# EAGLE schematic DRV8871 (EAGLE 9.1.3)
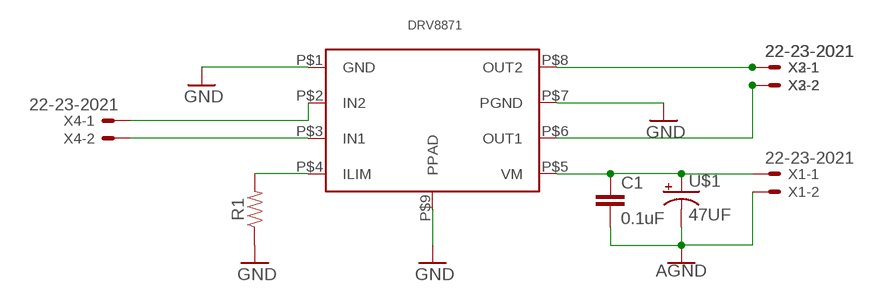
[diagram p0: schematic, sheet 1]

## Parts
C1  0.1uF  0.1UF-0402-16V-10%  [0402]
R1  RESISTOR0402  [0402]
U1  DRV8871  [DDA(R-PDSO-G8)]
U$1  47UF  [UCM1C470MCL1GS]
X1  22-23-2021  [22-23-2021]
X2  22-23-2021  [22-23-2021]
X3  22-23-2021  [22-23-2021]
X4  22-23-2021  [22-23-2021]

## Nets
AGND: C1.2 U$1.P$2(-) X1.2
GND: R1.1 U1.P$1(GND) U1.P$7(PGND) U1.P$9(PPAD)
N$1: R1.2 U1.P$4(ILIM)
N$2: C1.1 U1.P$5(VM) U$1.P$1(+) X1.1
N$3: U1.P$8(OUT2) X2.1 X3.1
N$4: U1.P$6(OUT1) X2.2 X3.2
N$6: U1.P$2(IN2) X4.1
N$7: U1.P$3(IN1) X4.2

## Library data of the parts
C1 = SparkFun-Capacitors:0.1UF: 0.1µF ceramic capacitors A capacitor is a passive two-terminal electrical component used to store electrical energy temporarily in an electric field.; PROD_ID: CAP-12416
R1 = SparkFun-Resistors:RESISTOR: Generic Resistor Package
U1 = Power:DRV8871
U$1 = capacitors:47UF
X1-X4 = con-molex:22-23-2021: .100" (2.54mm) Center Header - 2 Pin; MF: MOLEX; MPN: 22-23-2021; OC_FARNELL: 1462926; OC_NEWARK: 25C3832